# Altium schematic sheet control.SchDoc
size A4
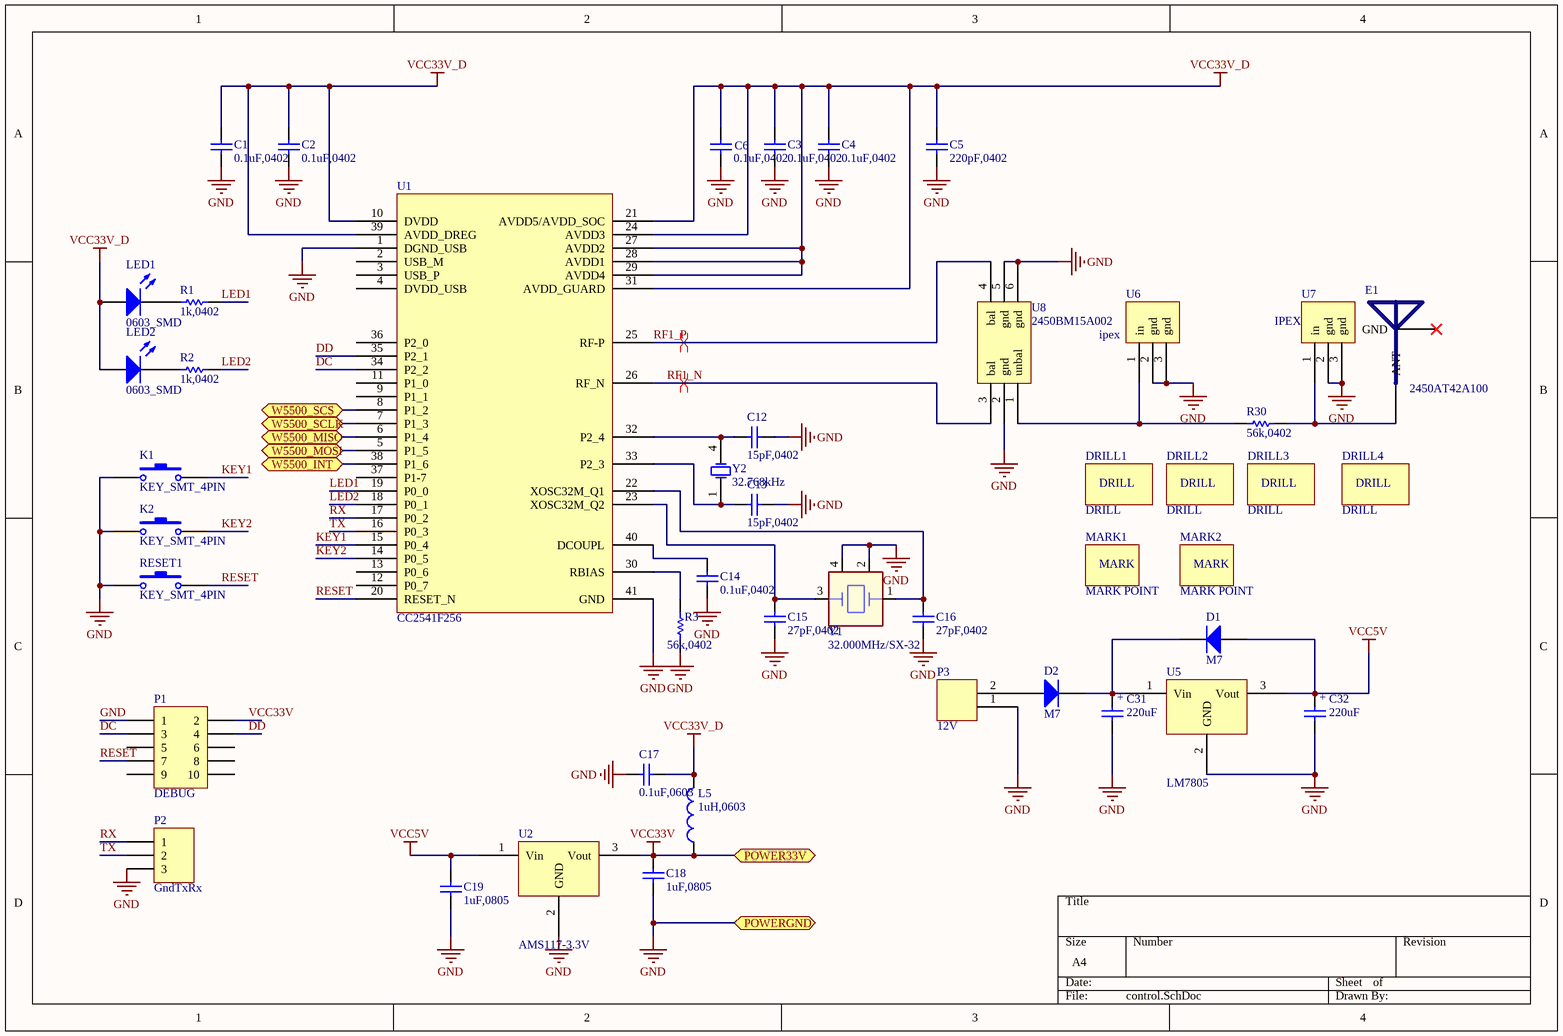
[diagram p0: control.SchDoc]

## Parts
C1  0.1uF,0402  [C0402]
C2  0.1uF,0402  [C0402]
C3  0.1uF,0402  [C0402]
C4  0.1uF,0402  [C0402]
C5  220pF,0402  [C0402]
C6  0.1uF,0402  [C0402]
C12  15pF,0402  [C0402]
C13  15pF,0402  [C0402]
C14  0.1uF,0402  [C0402]
C15  27pF,0402  [C0402]
C16  27pF,0402  [C0402]
C17  0.1uF,0603  [C0603]
C18  1uF,0805  [C0805]
C19  1uF,0805  [C0805]
C31  220uF  [CDIP2]
C32  220uF  [CDIP2]
D1  M7  [DO214AC]
D2  M7  [DO214AC]
DRILL1  DRILL  [DRILL_3MM]
DRILL2  DRILL  [DRILL_3MM]
DRILL3  DRILL  [DRILL_3MM]
DRILL4  DRILL  [DRILL_3MM]
E1  2450AT42A100  [BT_ANT_PCB]
K1  KEY_SMT_4PIN  [KEY-SMT]
K2  KEY_SMT_4PIN  [KEY-SMT]
L5  1uH,0603  [L0603]
LED1  0603_SMD  [LED0603]
LED2  0603_SMD  [LED0603]
MARK1  MARK POINT  [MARK_POINT]
MARK2  MARK POINT  [MARK_POINT]
P1  DEBUG  [HDR2X5]
P2  GndTxRx  [HDR1X3]
P3  12V  [2EDG-5.08-2P]
R1  1k,0402  [R0402]
R2  1k,0402  [R0402]
R3  56k,0402  [R0402]
R30  56k,0402  [R0805]
RESET1  KEY_SMT_4PIN  [KEY-SMT]
U1  CC2541F256  [PQFP40]
U2  AMS117-3.3V  [SOT223]
U5  LM7805  [SOT252]
U6  ipex  [IPEX]
U7  IPEX  [IPEX]
U8  2450BM15A002  [2450BM15A002]
Y1  32.000MHz/SX-32  [3225]
Y2  32.768kHz  [1206]

## Ports
POWER33V, POWERGND, W5500_INT, W5500_MISO, W5500_MOSI, W5500_SCLK, W5500_SCS

## Nets
GND: C1.1 C2.1 C3.1 C4.1 C5.1 C6.2 C12.1 C13.1 C14.1 C15.1 C16.1 C17.2 C18.1 C19.1 C31.2 C32.2 K1.1 K2.1 P1.1 P2.3 P3.1 R3.1 RESET1.1 U1.1(DGND_USB) U1.41(GND) U2.2(GND) U5.2(GND) U6.2(gnd) U6.3(gnd) U7.2(gnd) U7.3(gnd) U8.2(gnd) U8.5(gnd) U8.6(gnd) Y1.2 Y1.4 ; port POWERGND
VCC5V: C19.2 C32.1 D1.1(A) U2.1(Vin) U5.3(Vout)
VCC33V: C18.2 L5.1 P1.2 U2.3(Vout) ; port POWER33V
VCC33V_D: C1.2 C2.2 C3.2 C4.2 C5.2 C6.1 C17.1 L5.2 LED1.1(A) LED2.1(A) U1.10(DVDD) U1.21(AVDD5/AVDD_SOC) U1.24(AVDD3) U1.27(AVDD2) U1.28(AVDD1) U1.29(AVDD4) U1.31(AVDD_GUARD) U1.39(AVDD_DREG)
DC: P1.3 U1.34(P2_2)
DD: P1.4 U1.35(P2_1)
KEY1: K1.2 U1.15(P0_4)
KEY2: K2.2 U1.14(P0_5)
LED1: R1.2 U1.19(P0_0)
LED2: R2.2 U1.18(P0_1)
RESET: P1.7 RESET1.2 U1.20(RESET_N)
RF1_N: U1.26(RF_N) U8.3(bal)
RF1_P: U1.25(RF-P) U8.4(bal)
RX: P2.1 U1.17(P0_2)
TX: P2.2 U1.16(P0_3)
W5500_INT: U1.38(P1_6) ; port W5500_INT
W5500_MISO: U1.6(P1_4) ; port W5500_MISO
W5500_MOSI: U1.5(P1_5) ; port W5500_MOSI
W5500_SCLK: U1.7(P1_3) ; port W5500_SCLK
W5500_SCS: U1.8(P1_2) ; port W5500_SCS
NetC12_2: C12.2 U1.32(P2_4) Y2.4(OSC2)
NetC13_2: C13.2 U1.33(P2_3) Y2.1(OSC1)
NetC14_2: C14.2 U1.40(DCOUPL)
NetC15_2: C15.2 U1.23(XOSC32M_Q2) Y1.3
NetC16_2: C16.2 U1.22(XOSC32M_Q1) Y1.1
NetC31_1: C31.1 D1.2(K) D2.2(K) U5.1(Vin)
NetD2_1: D2.1(A) P3.2
NetE1_1: E1.1(ANT) R30.2 U7.1(in)
NetLED1_2: LED1.2(K) R1.1
NetLED2_2: LED2.2(K) R2.1
NetR3_2: R3.2 U1.30(RBIAS)
NetR30_1: R30.1 U6.1(in) U8.1(unbal)

Not connected (* = marked no-connect by the designer): E1 2(GND)*; P1 5 6 8 9 10; U1 2(USB_M) 3(USB_P) 4(DVDD_USB) 9(P1_1) 11(P1_0) 12(P0_7) 13(P0_6) 36(P2_0) 37(P1-7)

## Layout directives
differential pair: RF1_N, RF1_P

## Notes on the sheet
- (in symbol E_CAP) +
- (in symbol MARK_POINT) MARK

## Library data of the parts
C1-C6 C12-C19 = CAP: Capacitor; Published: 8-Jun-2000; Revision: July-2002: Re-released for DXP Platform.; Publisher: Altium Limited
  C1-C4 C6 C14 C17: Value: 0.1uF
  C5: Value: 220pF
  C12 C13: Value: 15pF
  C15 C16: Value: 27pF
  C18: value: 1uF
  C19: Value: 1uF
C31 C32 = E_CAP: electric capacitor; value: 220uF
D1 D2 = DIODE: value: M7
E1 = BT_ANT_PCB
K1 K2 RESET1 = KEY
L5 = Inductor: Code_IEC: 1005; Published: 8-Jun-2000; LatestRevisionDate: 17-Jul-2002; LatestRevisionNote: Re-released for DXP Platform.; PackageReference: 0402-A; Publisher: Altium Limited; Code_JEITA: 0402; Value: 1uH
LED1 LED2 = LED
MARK1 MARK2 = MARK_POINT
P1 = Header 5X2: Header, 5-Pin, Dual row; LatestRevisionDate: 17-Jul-2002; LatestRevisionNote: Re-released for DXP Platform.; Publisher: Altium Limited
P2 = Header 3: Header, 3-Pin; LatestRevisionDate: 17-Jul-2002; LatestRevisionNote: Re-released for DXP Platform.; Publisher: Altium Limited
P3 = 2EDG-5.08-2P
R1-R3 = Res1: Resistor; Published: 8-Jun-2000; Revision: July-2002: Re-released for DXP Platform.; Publisher: Altium Limited
  R1 R2: value: 1k
  R3: value: 56k
R30 = Res1: Resistor; value: 10k; Published: 8-Jun-2000; Revision: July-2002: Re-released for DXP Platform.; Publisher: Altium Limited
U1 = CC254x: TI cc2541F256; value: cc2541F256
U2 = VOLT_REG: voltage regulator tube; pin to pad: 1>3 2>1 3>2; value: ams1117-3.3V
U5 = VOLT_REG: voltage regulator tube; value: LM7805
Y1 = CRYSTAL_5: SPXO; value: 32MHz
Y2 = DA740C: crystal; pin to pad: 4>2; value: 32.768kHz